# Altium schematic sheet schematic.SchDoc
size A4
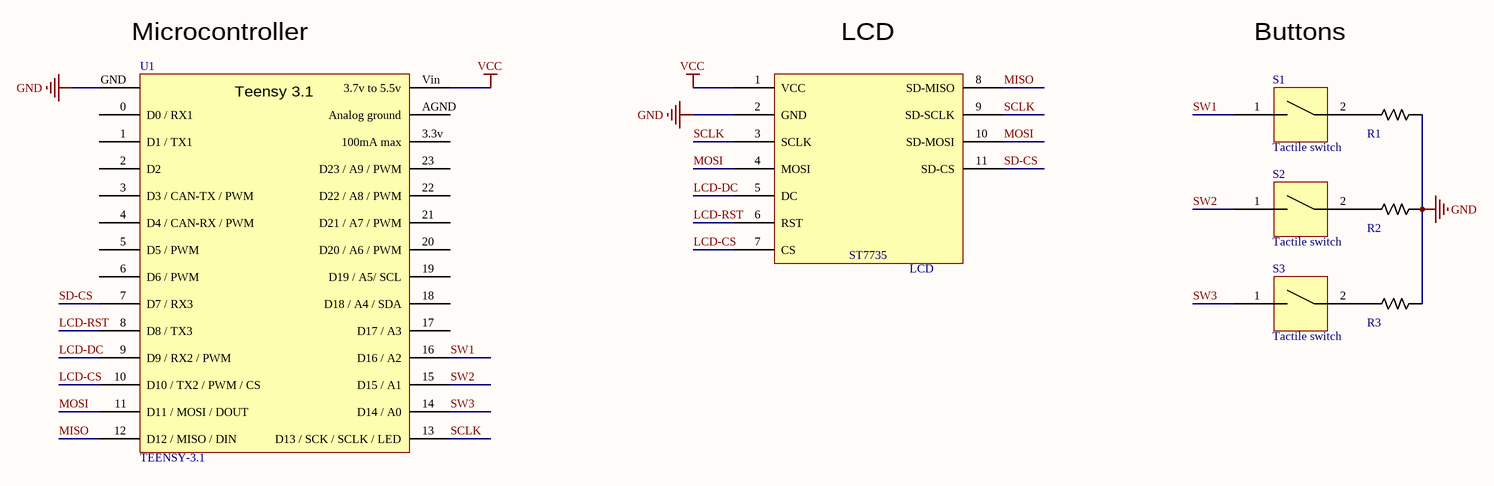
[diagram p0: schematic.SchDoc]

## Parts
LCD1  LCD  [ST7735]
R1  Resistor  [RESISTOR-0603]  (value not drawn)
R2  Resistor  [RESISTOR-0603]  (value not drawn)
R3  Resistor  [RESISTOR-0603]  (value not drawn)
S1  Tactile switch  [TACTILE-SWITCH]
S2  Tactile switch  [TACTILE-SWITCH]
S3  Tactile switch  [TACTILE-SWITCH]
U1  TEENSY-3.1  [TEENSY-3.1]

## Nets
GND: LCD1.2(GND) R1.2 R2.2 R3.2 U1.GND
VCC: LCD1.1(VCC) U1.Vin(3.7v_to_5.5v)
LCD-CS: LCD1.7(CS) U1.10(D10_/_TX2_/_PWM_/_CS)
LCD-DC: LCD1.5(DC) U1.9(D9_/_RX2_/_PWM)
LCD-RST: LCD1.6(RST) U1.8(D8_/_TX3)
MISO: LCD1.8(SD-MISO) U1.12(D12_/_MISO_/_DIN)
MOSI: LCD1.4(MOSI) LCD1.10(SD-MOSI) U1.11(D11_/_MOSI_/_DOUT)
SCLK: LCD1.3(SCLK) LCD1.9(SD-SCLK) U1.13(D13_/_SCK_/_SCLK_/_LED)
SD-CS: LCD1.11(SD-CS) U1.7(D7_/_RX3)
SW1: S1.1 U1.16(D16_/_A2)
SW2: S2.1 U1.15(D15_/_A1)
SW3: S3.1 U1.14(D14_/_A0)
NetR1_1: R1.1 S1.2
NetR2_1: R2.1 S2.2
NetR3_1: R3.1 S3.2

Not connected (* = marked no-connect by the designer): U1 0(D0_/_RX1) 1(D1_/_TX1) 2(D2) 3(D3_/_CAN-TX_/_PWM) 3.3v(100mA_max) 4(D4_/_CAN-RX_/_PWM) 5(D5_/_PWM) 6(D6_/_PWM) 17(D17_/_A3) 18(D18_/_A4_/_SDA) 19(D19_/_A5/_SCL) 20(D20_/_A6_/_PWM) 21(D21_/_A7_/_PWM) 22(D22_/_A8_/_PWM) 23(D23_/_A9_/_PWM) AGND(Analog_ground)

## Notes on the sheet
- (near U1) Microcontroller
- (near LCD1) LCD
- Buttons
- (in symbol TEENSY-3.1) Teensy 3.1

## Library data of the parts
LCD1 = ST7735
S1-S3 = TACTILE-SWITCH
U1 = TEENSY-3.1: Teensy 3.1 breakout